# Altium schematic sheet MCU.SchDoc
size Letter; DrawnBy: Robson Souza; SheetNumber: 2; SheetTotal: 10
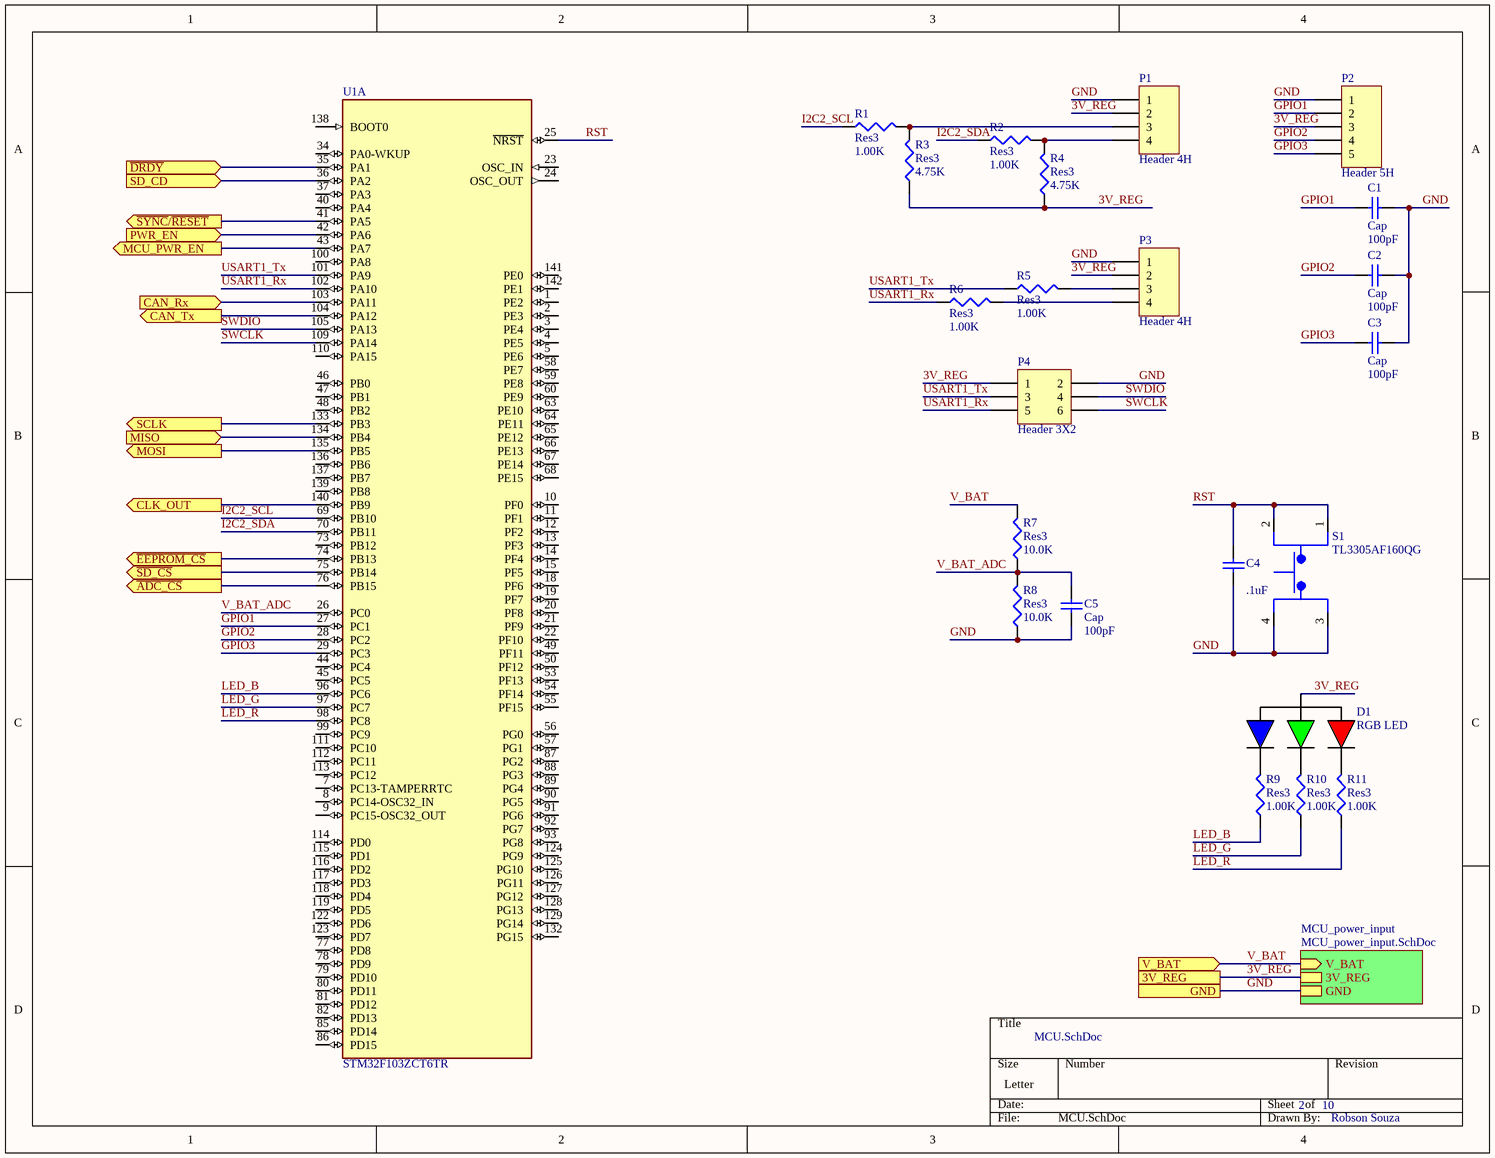
[diagram p0: MCU.SchDoc]

## Parts
C1  Cap  value 100pF  [CAPC2012X09M]
C2  Cap  value 100pF  [CAPC2012X09M]
C3  Cap  value 100pF  [CAPC2012X09M]
C4  value .1uF  [CAPC2012X09M]  (hidden comment: CAP CER 50v X7R 0805)
C5  Cap  value 100pF  [CAPC2012X09M]
D1  RGB LED  [SML-LX0303RGBC1TR]
P1  Header 4H  [HDR1X4H]
P2  Header 5H  [HDR1X5H]
P3  Header 4H  [HDR1X4H]
P4  Header 3X2  [HDR2X3]
R1  Res3  value 1.00K  [RESC2112X05M]
R2  Res3  value 1.00K  [RESC2112X05M]
R3  Res3  value 4.75K  [RESC2112X05M]
R4  Res3  value 4.75K  [RESC2112X05M]
R5  Res3  value 1.00K  [RESC2112X05M]
R6  Res3  value 1.00K  [RESC2112X05M]
R7  Res3  value 10.0K  [RESC2112X05M]
R8  Res3  value 10.0K  [RESC2112X05M]
R9  Res3  value 1.00K  [RESC2112X05M]
R10  Res3  value 1.00K  [RESC2112X05M]
R11  Res3  value 1.00K  [RESC2112X05M]
S1  TL3305AF160QG  [SW_TL3305AF160QG]
U1  STM32F103ZCT6TR  [QFP50P2200X2200X160-144N]  (part A of 2)

## Sub-sheets
MCU_power_input = MCU_power_input.SchDoc: V_BAT (in), 3V_REG, GND

## Ports
3V_REG, CAN_Rx (in), CAN_Tx (out), CLK_OUT (out), GND, MCU_PWR_EN (out), MISO (in), MOSI (out), PWR_EN (in), SCLK (out), SD_CD (in), V_BAT (in), ~{ADC_CS} (out), ~{DRDY} (in), ~{EEPROM_CS} (out), ~{SD_CS} (out), ~{SYNC}/~{RESET} (out)

## Nets
3V_REG: D1.1 P1.2 P2.3 P3.2 P4.1 R3.1 R4.1 ; port 3V_REG, sheet MCU_power_input/3V_REG
~{ADC_CS}: U1.76(PB15) ; port ~{ADC_CS}
CAN_Rx: U1.103(PA11) ; port CAN_Rx
CAN_Tx: U1.104(PA12) ; port CAN_Tx
CLK_OUT: U1.140(PB9) ; port CLK_OUT
~{DRDY}: U1.35(PA1) ; port ~{DRDY}
~{EEPROM_CS}: U1.74(PB13) ; port ~{EEPROM_CS}
GND: C1.1 C2.1 C3.1 C4.1 C5.1 P1.1 P2.1 P3.1 P4.2 R8.1 S1.3 S1.4 ; port GND, sheet MCU_power_input/GND
GPIO1: C1.2 P2.2 U1.27(PC1)
GPIO2: C2.2 P2.4 U1.28(PC2)
GPIO3: C3.2 P2.5 U1.29(PC3)
I2C2_SCL: R1.1 U1.69(PB10)
I2C2_SDA: R2.1 U1.70(PB11)
LED_B: R9.1 U1.96(PC6)
LED_G: R10.1 U1.97(PC7)
LED_R: R11.1 U1.98(PC8)
MCU_PWR_EN: U1.43(PA7) ; port MCU_PWR_EN
MISO: U1.134(PB4) ; port MISO
MOSI: U1.135(PB5) ; port MOSI
PWR_EN: U1.42(PA6) ; port PWR_EN
RST: C4.2 S1.1 S1.2 U1.25(~{NRST})
~{SD_CS}: U1.75(PB14) ; port ~{SD_CS}
~{SYNC}/~{RESET}: U1.41(PA5) ; port ~{SYNC}/~{RESET}
SCLK: U1.133(PB3) ; port SCLK
SD_CD: U1.36(PA2) ; port SD_CD
SWCLK: P4.6 U1.109(PA14)
SWDIO: P4.4 U1.105(PA13)
USART1_Rx: P4.5 R6.1 U1.102(PA10)
USART1_Tx: P4.3 R5.1 U1.101(PA9)
V_BAT: R7.2 ; port V_BAT, sheet MCU_power_input/V_BAT
V_BAT_ADC: C5.2 R7.1 R8.2 U1.26(PC0)
NetD1_2: D1.2 R11.2
NetD1_3: D1.3 R10.2
NetD1_4: D1.4 R9.2
NetP1_3: P1.3 R1.2 R3.2
NetP1_4: P1.4 R2.2 R4.2
NetP3_3: P3.3 R5.2
NetP3_4: P3.4 R6.2

Not connected (* = marked no-connect by the designer): U1 1(PE2) 2(PE3) 3(PE4) 4(PE5) 5(PE6) 7(PC13-TAMPERRTC) 8(PC14-OSC32_IN) 9(PC15-OSC32_OUT) 10(PF0) 11(PF1) 12(PF2) 13(PF3) 14(PF4) 15(PF5) 18(PF6) 19(PF7) 20(PF8) 21(PF9) 22(PF10) 23(OSC_IN) 24(OSC_OUT) 34(PA0-WKUP) 37(PA3) 40(PA4) 44(PC4) 45(PC5) 46(PB0) 47(PB1) 48(PB2) 49(PF11) 50(PF12) 53(PF13) 54(PF14) 55(PF15) 56(PG0) 57(PG1) 58(PE7) 59(PE8) 60(PE9) 63(PE10) 64(PE11) 65(PE12) 66(PE13) 67(PE14) 68(PE15) 73(PB12) 77(PD8) 78(PD9) 79(PD10) 80(PD11) 81(PD12) 82(PD13) 85(PD14) 86(PD15) 87(PG2) 88(PG3) 89(PG4) 90(PG5) 91(PG6) 92(PG7) 93(PG8) 99(PC9) 100(PA8) 110(PA15) 111(PC10) 112(PC11) 113(PC12) 114(PD0) 115(PD1) 116(PD2) 117(PD3) 118(PD4) 119(PD5) 122(PD6) 123(PD7) 124(PG9) 125(PG10) 126(PG11) 127(PG12) 128(PG13) 129(PG14) 132(PG15) 136(PB6) 137(PB7) 138(BOOT0) 139(PB8) 141(PE0) 142(PE1)

## Library data of the parts
C1-C3 C5 = CAP-COG-100pF-500V-±5%: CAP CER 100pF 500v COG 0805; MPN: C0805C101JCGACTU; WV: 500; Tolerance: ±5%; PN: 399-5102-1-ND; Name: CAP-COG-100pF-500V-±5%; Type: COG; URL: http://www.digikey.ca/product-detail/en/C0805C101JCGACTU/399-5102-1-ND
C4 = CAP-X7R-.1uF-50V-±5%: MPN: C0805C104J5RACTU; WV: 50; Tolerance: ±5%; PN: 399-1171-1-ND; Name: CAP-X7R-.1uF-50V-±5%; Type: X7R; URL: http://www.digikey.ca/product-detail/en/C0805C104J5RACTU/399-1171-1-ND
D1 = SML-LX0303RGBC/1TR: MP: SML-LX0303RGBC/1TR
P1 P3 = Header 4H: Header, 4-Pin, Right Angle; LatestRevisionDate: 17-Jul-2002; LatestRevisionNote: Re-released for DXP Platform.; Publisher: Altium Limited
P2 = Header 5H: Header, 5-Pin, Right Angle; LatestRevisionDate: 17-Jul-2002; LatestRevisionNote: Re-released for DXP Platform.; Publisher: Altium Limited
P4 = Header 3X2: Header, 3-Pin, Dual row; LatestRevisionDate: 17-Jul-2002; LatestRevisionNote: Re-released for DXP Platform.; Publisher: Altium Limited
R1 R2 R5 R6 R9-R11 = Resistor_1.00K: RES SMD 1.00K OHM 1% 1/8W 0805; MPN: CRCW08051K00FKEA; PN: 541-1.00KCCT-ND; Name: Resistor_1.00K; URL: http://www.digikey.ca/product-detail/en/CRCW08051K00FKEA/541-1.00KCCT-ND
R3 R4 = Resistor_4.75K: RES SMD 4.75K OHM 1% 1/8W 0805; MPN: CRCW08054K75FKEA; PN: 541-4.75KCCT-ND; Name: Resistor_4.75K; URL: http://www.digikey.ca/product-detail/en/CRCW08054K75FKEA/541-4.75KCCT-ND
R7 R8 = Resistor_10.0K: RES SMD 10.0K OHM 1% 1/8W 0805; MPN: CRCW080510K0FKEA; PN: 541-10.0KCCT-ND; Name: Resistor_10.0K; URL: http://www.digikey.ca/product-detail/en/CRCW080510K0FKEA/541-10.0KCCT-ND
S1 = TL3305AF160QG: Tactile Switch SPST-NO Top Actuated Surface Mount; MF: E-Switch; Check_prices: https://www.snapeda.com/parts/TL3305AF160QG/E-Switch/view-part/?ref=eda; SnapEDA_Link: https://www.snapeda.com/parts/TL3305AF160QG/E-Switch/view-part/?ref=snap; Price: None; Availability: In Stock; Value: TL3305AF160QG; MP: TL3305AF160QG; Package: None; Purchase-URL: https://pricing.snapeda.com/search/part/TL3305AF160QG/?ref=eda
U1 = STM32F103ZCT6TR: ARM® Cortex®-M3 series Microcontroller IC 32-Bit Single-Core 72MHz 256KB (256K x 8) FLASH 144-LQFP (20x20); MF: STMicroelectronics; Check_prices: https://www.snapeda.com/parts/STM32F103ZCT6TR/STMicroelectronics/view-part/?ref=eda; SnapEDA_Link: https://www.snapeda.com/parts/STM32F103ZCT6TR/STMicroelectronics/view-part/?ref=snap; MP: STM32F103ZCT6TR; Purchase-URL: https://pricing.snapeda.com/search/part/STM32F103ZCT6TR/?ref=eda; Digi-Key_Part_Number: 497-18761-2-ND; Package: LQFP-144 STMicroelectronics; Value: *